# Altium schematic sheet G1-CM4.SchDoc
size A2; SheetNumber: 1; SheetTotal: 3
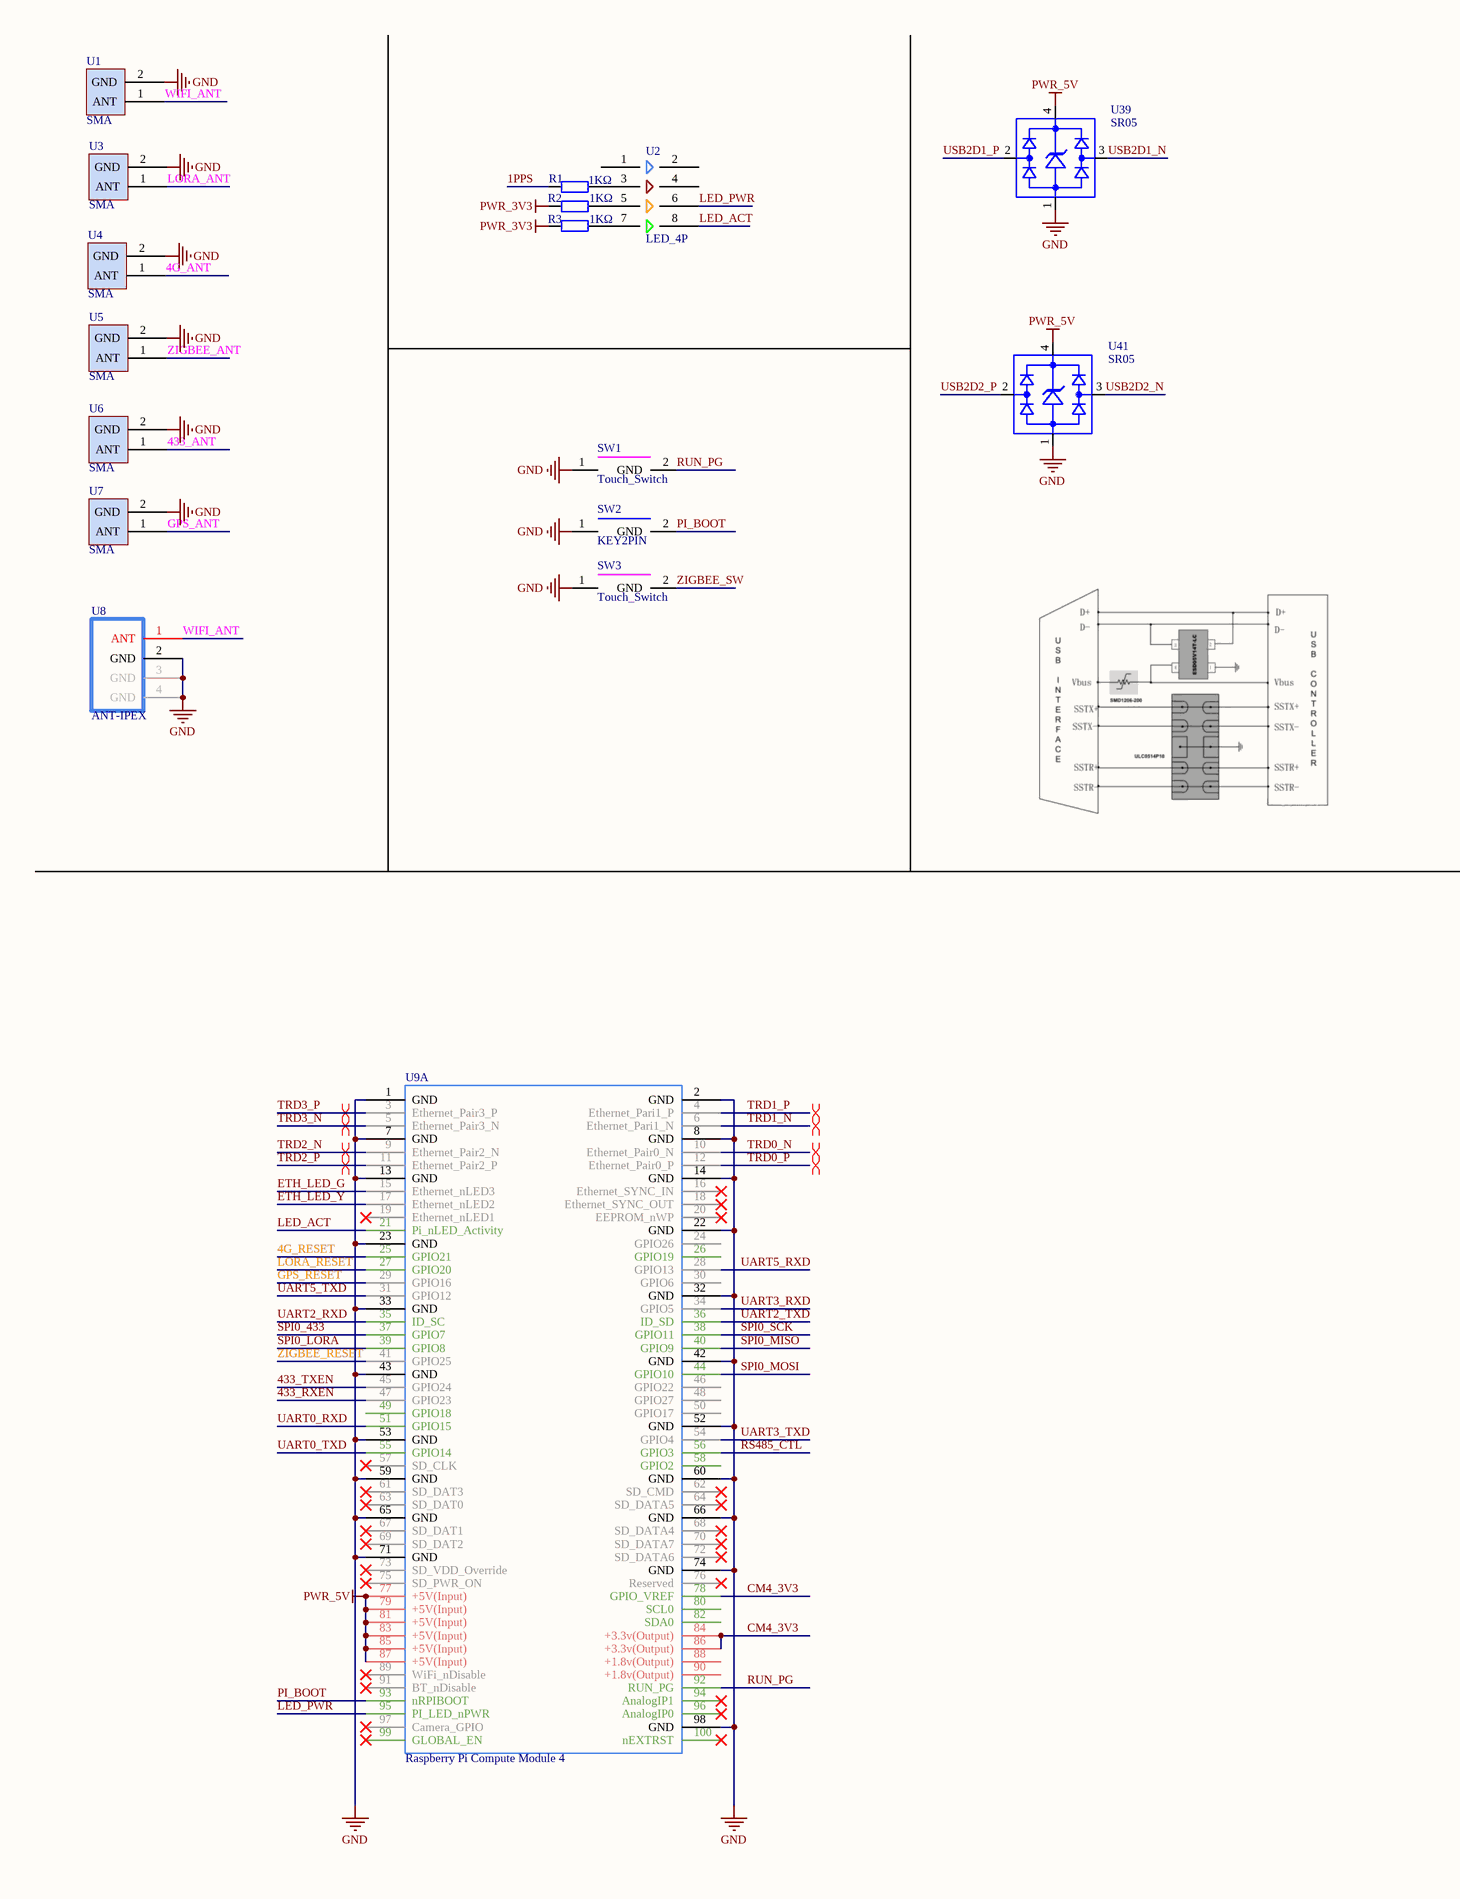
[diagram p0: G1-CM4.SchDoc, left]
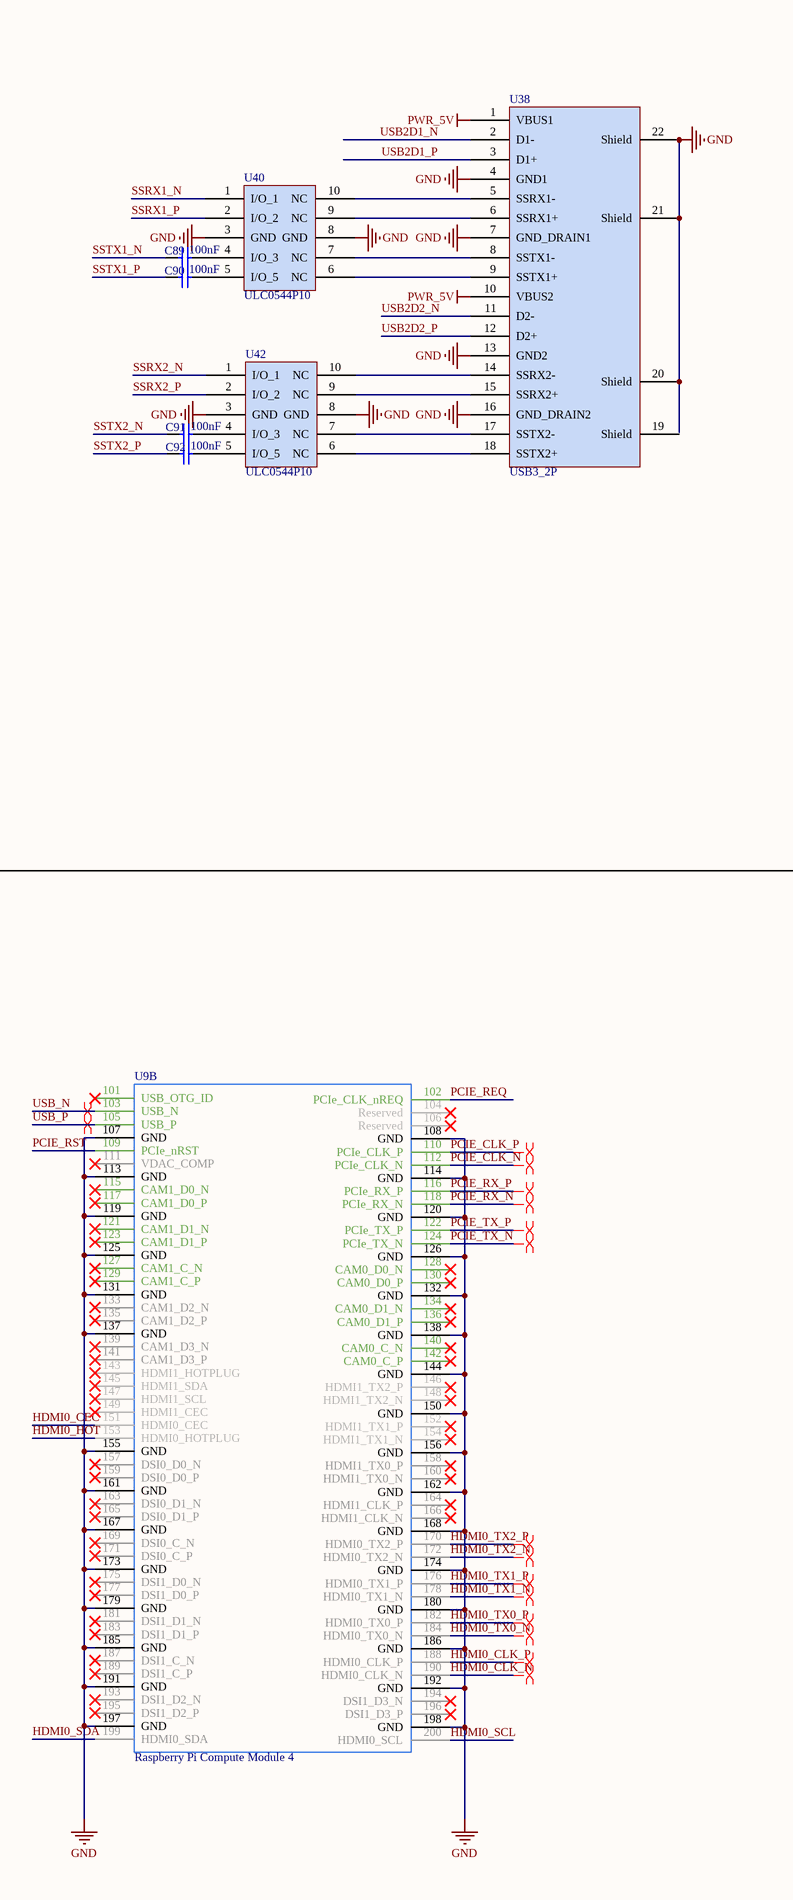
[diagram p1: G1-CM4.SchDoc, right]

## Parts
C89  100nF  [0402_C]
C90  100nF  [0402_C]
C91  100nF  [0402_C]
C92  100nF  [0402_C]
R1  1KΩ  [0402_R]
R2  1KΩ  [0402_R]
R3  1KΩ  [0402_R]
SW1  Touch_Switch  [Touch_Switch]
SW2  KEY2PIN  [KEY2PIN]
SW3  Touch_Switch  [Touch_Switch]
U1  SMA  [SMA]
U2  LED_4P  [LED_4P]
U3  SMA  [SMA]
U4  SMA  [SMA]
U5  SMA  [SMA]
U6  SMA  [SMA]
U7  SMA  [SMA]
U8  ANT-IPEX  [ANT-IPEX]
U9  Raspberry Pi Compute Module 4  [CM4T-DF40HC(3.0)-100DS]  (parts A,B of 2)
U38  USB3_2P  [USB3_2P]
U39  SR05  [SR05]
U40  ULC0544P10  [ULC0544P10]
U41  SR05  [SR05]
U42  ULC0544P10  [ULC0544P10]

## Nets
GND: SW1.1 SW2.1 SW3.1 U1.2(GND) U3.2(GND) U4.2(GND) U5.2(GND) U6.2(GND) U7.2(GND) U8.2(GND) U8.3(GND) U8.4(GND) U9.1(GND) U9.2(GND) U9.7(GND) U9.8(GND) U9.13(GND) U9.14(GND) U9.22(GND) U9.23(GND) U9.32(GND) U9.33(GND) U9.42(GND) U9.43(GND) U9.52(GND) U9.53(GND) U9.59(GND) U9.60(GND) U9.65(GND) U9.66(GND) U9.71(GND) U9.74(GND) U9.98(GND) U9.107(GND) U9.108(GND) U9.113(GND) U9.114(GND) U9.119(GND) U9.120(GND) U9.125(GND) U9.126(GND) U9.131(GND) U9.132(GND) U9.137(GND) U9.138(GND) U9.144(GND) U9.150(GND) U9.155(GND) U9.156(GND) U9.161(GND) U9.162(GND) U9.167(GND) U9.168(GND) U9.173(GND) U9.174(GND) U9.179(GND) U9.180(GND) U9.185(GND) U9.186(GND) U9.191(GND) U9.192(GND) U9.197(GND) U9.198(GND) U38.4(GND1) U38.7(GND_DRAIN1) U38.13(GND2) U38.16(GND_DRAIN2) U38.20(Shield) U38.21(Shield) U38.22(Shield) U39.1 U40.3(GND) U40.8(GND) U41.1 U42.3(GND) U42.8(GND)
PWR_3V3: R2.1 R3.1
PWR_5V: U9.77(+5V(Input)) U9.79(+5V(Input)) U9.81(+5V(Input)) U9.83(+5V(Input)) U9.85(+5V(Input)) U9.87(+5V(Input)) U38.1(VBUS1) U38.10(VBUS2) U39.4 U41.4
1PPS: R1.1
4G_ANT: U4.1(ANT)
4G_RESET: U9.25(GPIO21)
433_ANT: U6.1(ANT)
433_RXEN: U9.47(GPIO23)
433_TXEN: U9.45(GPIO24)
CM4_3V3: U9.78(GPIO_VREF) U9.84(+3.3v(Output)) U9.86(+3.3v(Output))
ETH_LED_G: U9.15(Ethernet_nLED3)
ETH_LED_Y: U9.17(Ethernet_nLED2)
GPS_ANT: U7.1(ANT)
GPS_RESET: U9.29(GPIO16)
HDMI0_CEC: U9.151(HDMI0_CEC)
HDMI0_CLK_N: U9.190(HDMI0_CLK_N)
HDMI0_CLK_P: U9.188(HDMI0_CLK_P)
HDMI0_HOT: U9.153(HDMI0_HOTPLUG)
HDMI0_SCL: U9.200(HDMI0_SCL)
HDMI0_SDA: U9.199(HDMI0_SDA)
HDMI0_TX0_N: U9.184(HDMI0_TX0_N)
HDMI0_TX0_P: U9.182(HDMI0_TX0_P)
HDMI0_TX1_N: U9.178(HDMI0_TX1_N)
HDMI0_TX1_P: U9.176(HDMI0_TX1_P)
HDMI0_TX2_N: U9.172(HDMI0_TX2_N)
HDMI0_TX2_P: U9.170(HDMI0_TX2_P)
LED_ACT: U2.8 U9.21(Pi_nLED_Activity)
LED_PWR: U2.6 U9.95(PI_LED_nPWR)
LORA_ANT: U3.1(ANT)
LORA_RESET: U9.27(GPIO20)
PCIE_CLK_N: U9.112(PCIe_CLK_N)
PCIE_CLK_P: U9.110(PCIe_CLK_P)
PCIE_REQ: U9.102(PCIe_CLK_nREQ)
PCIE_RST: U9.109(PCIe_nRST)
PCIE_RX_N: U9.118(PCIe_RX_N)
PCIE_RX_P: U9.116(PCIe_RX_P)
PCIE_TX_N: U9.124(PCIe_TX_N)
PCIE_TX_P: U9.122(PCIe_TX_P)
PI_BOOT: SW2.2(GND) U9.93(nRPIBOOT)
RS485_CTL: U9.56(GPIO3)
RUN_PG: SW1.2(GND) U9.92(RUN_PG)
SPI0_433: U9.37(GPIO7)
SPI0_LORA: U9.39(GPIO8)
SPI0_MISO: U9.40(GPIO9)
SPI0_MOSI: U9.44(GPIO10)
SPI0_SCK: U9.38(GPIO11)
SSRX1_N: U40.1(I/O_1)
SSRX1_P: U40.2(I/O_2)
SSRX2_N: U42.1(I/O_1)
SSRX2_P: U42.2(I/O_2)
SSTX1_N: C89.1
SSTX1_P: C90.1
SSTX2_N: C91.1
SSTX2_P: C92.1
TRD0_N: U9.10(Ethernet_Pair0_N)
TRD0_P: U9.12(Ethernet_Pair0_P)
TRD1_N: U9.6(Ethernet_Pari1_N)
TRD1_P: U9.4(Ethernet_Pari1_P)
TRD2_N: U9.9(Ethernet_Pair2_N)
TRD2_P: U9.11(Ethernet_Pair2_P)
TRD3_N: U9.5(Ethernet_Pair3_N)
TRD3_P: U9.3(Ethernet_Pair3_P)
UART0_RXD: U9.51(GPIO15)
UART0_TXD: U9.55(GPIO14)
UART2_RXD: U9.35(ID_SC)
UART2_TXD: U9.36(ID_SD)
UART3_RXD: U9.34(GPIO5)
UART3_TXD: U9.54(GPIO4)
UART5_RXD: U9.28(GPIO13)
UART5_TXD: U9.31(GPIO12)
USB2D1_N: U38.2(D1-) U39.3
USB2D1_P: U38.3(D1+) U39.2
USB2D2_N: U38.11(D2-) U41.3
USB2D2_P: U38.12(D2+) U41.2
USB_N: U9.103(USB_N)
USB_P: U9.105(USB_P)
WIFI_ANT: U1.1(ANT) U8.1(ANT)
ZIGBEE_ANT: U5.1(ANT)
ZIGBEE_RESET: U9.41(GPIO25)
ZIGBEE_SW: SW3.2(GND)
NetC89_2: C89.2 U40.4(I/O_3)
NetC90_2: C90.2 U40.5(I/O_5)
NetC91_2: C91.2 U42.4(I/O_3)
NetC92_2: C92.2 U42.5(I/O_5)
NetR1_2: R1.2 U2.3
NetR2_2: R2.2 U2.5
NetR3_2: R3.2 U2.7
NetU38_5: U38.5(SSRX1-) U40.10(NC)
NetU38_6: U38.6(SSRX1+) U40.9(NC)
NetU38_8: U38.8(SSTX1-) U40.7(NC)
NetU38_9: U38.9(SSTX1+) U40.6(NC)
NetU38_14: U38.14(SSRX2-) U42.10(NC)
NetU38_15: U38.15(SSRX2+) U42.9(NC)
NetU38_17: U38.17(SSTX2-) U42.7(NC)
NetU38_18: U38.18(SSTX2+) U42.6(NC)

Not connected (* = marked no-connect by the designer): U2 1 2 4; U9 16(Ethernet_SYNC_IN)* 18(Ethernet_SYNC_OUT)* 19(Ethernet_nLED1)* 20(EEPROM_nWP)* 24(GPIO26) 26(GPIO19) 30(GPIO6) 46(GPIO22) 48(GPIO27) 49(GPIO18) 50(GPIO17) 57(SD_CLK)* 58(GPIO2) 61(SD_DAT3)* 62(SD_CMD)* 63(SD_DAT0)* 64(SD_DATA5)* 67(SD_DAT1)* 68(SD_DATA4)* 69(SD_DAT2)* 70(SD_DATA7)* 72(SD_DATA6)* 73(SD_VDD_Override)* 75(SD_PWR_ON)* 76(Reserved)* 80(SCL0) 82(SDA0) 88(+1.8v(Output)) 89(WiFi_nDisable)* 90(+1.8v(Output)) 91(BT_nDisable)* 94(AnalogIP1)* 96(AnalogIP0)* 97(Camera_GPIO)* 99(GLOBAL_EN)* 100(nEXTRST)* 101(USB_OTG_ID)* 104(Reserved)* 106(Reserved)* 111(VDAC_COMP)* 115(CAM1_D0_N)* 117(CAM1_D0_P)* 121(CAM1_D1_N)* 123(CAM1_D1_P)* 127(CAM1_C_N)* 128(CAM0_D0_N)* 129(CAM1_C_P)* 130(CAM0_D0_P)* 133(CAM1_D2_N)* 134(CAM0_D1_N)* 135(CAM1_D2_P)* 136(CAM0_D1_P)* 139(CAM1_D3_N)* 140(CAM0_C_N)* 141(CAM1_D3_P)* 142(CAM0_C_P)* 143(HDMI1_HOTPLUG)* 145(HDMI1_SDA)* 146(HDMI1_TX2_P)* 147(HDMI1_SCL)* 148(HDMI1_TX2_N)* 149(HDMI1_CEC)* 152(HDMI1_TX1_P)* 154(HDMI1_TX1_N)* 157(DSI0_D0_N)* 158(HDMI1_TX0_P)* 159(DSI0_D0_P)* 160(HDMI1_TX0_N)* 163(DSI0_D1_N)* 164(HDMI1_CLK_P)* 165(DSI0_D1_P)* 166(HDMI1_CLK_N)* 169(DSI0_C_N)* 171(DSI0_C_P)* 175(DSI1_D0_N)* 177(DSI1_D0_P)* 181(DSI1_D1_N)* 183(DSI1_D1_P)* 187(DSI1_C_N)* 189(DSI1_C_P)* 193(DSI1_D2_N)* 194(DSI1_D3_N)* 195(DSI1_D2_P)* 196(DSI1_D3_P)*; U38 19(Shield)

## Layout directives
differential pair: HDMI0_CLK_N, HDMI0_CLK_P, HDMI0_TX0_N, HDMI0_TX0_P, HDMI0_TX1_N, HDMI0_TX1_P, HDMI0_TX2_N, HDMI0_TX2_P, PCIE_CLK_N, PCIE_CLK_P, PCIE_RX_N, PCIE_RX_P, PCIE_TX_N, PCIE_TX_P, TRD0_N, TRD0_P, TRD1_N, TRD1_P, TRD2_N, TRD2_P, TRD3_N, TRD3_P, USB_N, USB_P

## Library data of the parts
C89-C92 = 0402 100nF (104) 10% 16V: 贴片电容; ComponentLink1Description: 供应商链接; ComponentLink1URL: http://www.szlcsc.com/product/details_1877.html; Package: 0402; Supplier: LC; SuppliersPartNumber: C1525
R1-R3 = 0402 1KΩ (1001) 1%: 贴片电阻; ComponentLink1Description: 供应商链接; ComponentLink1URL: http://www.szlcsc.com/product/details_12256.html; Package: 0402; Supplier: LC; SuppliersPartNumber: C11702
SW1 SW3 = Touch_Switch: Touch_Switch 2PIN
SW2 = KEY2PIN: Switch Button
U1 U3-U7 = SMA: SMA ANT
U2 = LED_4P: LED
U8 = ANT-IPEX: ANT
U9 = CM4
U38 = USB3_2P: USB3.0 2Ports
U40 U42 = ULC0544P10: ESD